# Altium schematic sheet Motor Control.SchDoc
size A
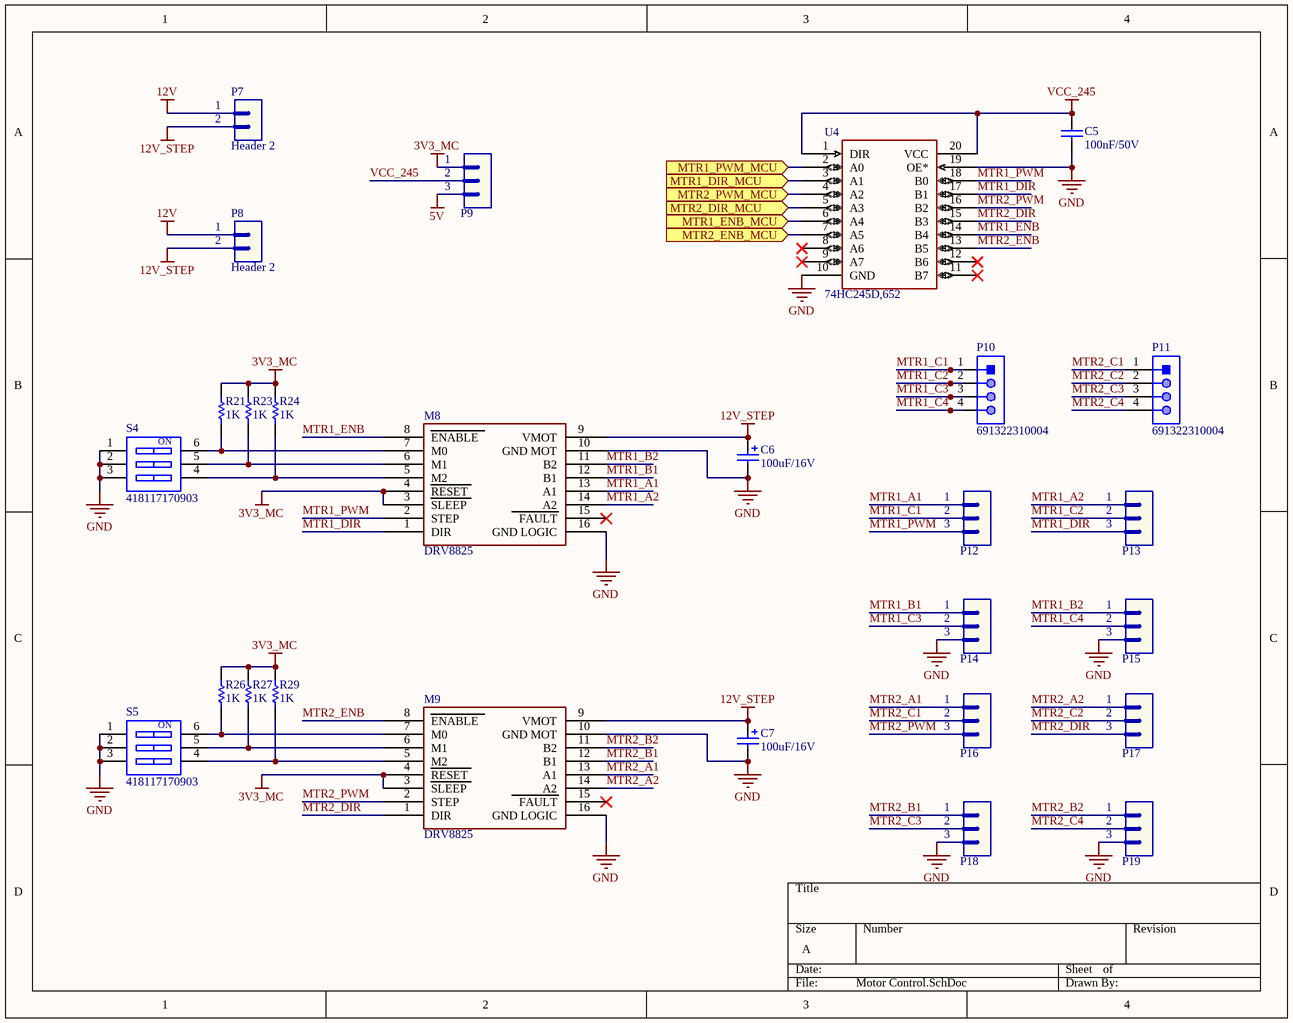
[diagram p0: Motor Control.SchDoc]

## Parts
C5  value 100nF/50V  [CAP-SM-0805]  (hidden comment: Cap-100nF-50V-0805)
C6  value 100uF/16V  [CAP-SM-AL-SIZE-D-D6L6]  (hidden comment: Cap-Al-100uF-16V-D6L5)
C7  value 100uF/16V  [CAP-SM-AL-SIZE-D-D6L6]  (hidden comment: Cap-Al-100uF-16V-D6L5)
M8  DRV8825  [DRV8825]
M9  DRV8825  [DRV8825]
P7  Header 2  [JP2]
P8  Header 2  [JP2]
P9  Header 3  [JP3]  (value not drawn)
P10  691322310004  [691322310004]
P11  691322310004  [691322310004]
P12  Header 3  [JP3]  (value not drawn)
P13  Header 3  [JP3]  (value not drawn)
P14  Header 3  [JP3]  (value not drawn)
P15  Header 3  [JP3]  (value not drawn)
P16  Header 3  [JP3]  (value not drawn)
P17  Header 3  [JP3]  (value not drawn)
P18  Header 3  [JP3]  (value not drawn)
P19  Header 3  [JP3]  (value not drawn)
R21  value 1K  [RES-SM-0805]  (hidden comment: Res-1K-0805)
R23  value 1K  [RES-SM-0805]  (hidden comment: Res-1K-0805)
R24  value 1K  [RES-SM-0805]  (hidden comment: Res-1K-0805)
R26  value 1K  [RES-SM-0805]  (hidden comment: Res-1K-0805)
R27  value 1K  [RES-SM-0805]  (hidden comment: Res-1K-0805)
R29  value 1K  [RES-SM-0805]  (hidden comment: Res-1K-0805)
S4  418117170903  [418117170903]
S5  418117170903  [418117170903]
U4  74HC245D,652  [SOT163-1_NEX]

## Ports
MTR1_DIR_MCU (in), MTR1_ENB_MCU (in), MTR1_PWM_MCU (in), MTR2_DIR_MCU (in), MTR2_ENB_MCU (in), MTR2_PWM_MCU (in)

## Nets
3V3_MC: M8.3(SLEEP) M8.4(RESET) M9.3(SLEEP) M9.4(RESET) P9.1 R21.2 R23.2 R24.2 R26.2 R27.2 R29.2
5V: P9.3
12V: P7.1 P8.1
12V_STEP: C6.1 C7.1 M8.9(VMOT) M9.9(VMOT) P7.2 P8.2
GND: C5.1 C6.2 C7.2 M8.10(GND_MOT) M8.16(GND_LOGIC) M9.10(GND_MOT) M9.16(GND_LOGIC) P14.3 P15.3 P18.3 P19.3 S4.1 S4.2 S4.3 S5.1 S5.2 S5.3 U4.10(GND) U4.19(OE*)
VCC_245: C5.2 P9.2 U4.1(DIR) U4.20(VCC)
MTR1_A1: M8.13(A1) P12.1
MTR1_A2: M8.14(A2) P13.1
MTR1_B1: M8.12(B1) P14.1
MTR1_B2: M8.11(B2) P15.1
MTR1_C1: P10.1 P12.2
MTR1_C2: P10.2 P13.2
MTR1_C3: P10.3 P14.2
MTR1_C4: P10.4 P15.2
MTR1_DIR: M8.1(DIR) P13.3 U4.17(B1)
MTR1_DIR_MCU: U4.3(A1) ; port MTR1_DIR_MCU
MTR1_ENB: M8.8(ENABLE) U4.14(B4)
MTR1_ENB_MCU: U4.6(A4) ; port MTR1_ENB_MCU
MTR1_PWM: M8.2(STEP) P12.3 U4.18(B0)
MTR1_PWM_MCU: U4.2(A0) ; port MTR1_PWM_MCU
MTR2_A1: M9.13(A1) P16.1
MTR2_A2: M9.14(A2) P17.1
MTR2_B1: M9.12(B1) P18.1
MTR2_B2: M9.11(B2) P19.1
MTR2_C1: P11.1 P16.2
MTR2_C2: P11.2 P17.2
MTR2_C3: P11.3 P18.2
MTR2_C4: P11.4 P19.2
MTR2_DIR: M9.1(DIR) P17.3 U4.15(B3)
MTR2_DIR_MCU: U4.5(A3) ; port MTR2_DIR_MCU
MTR2_ENB: M9.8(ENABLE) U4.13(B5)
MTR2_ENB_MCU: U4.7(A5) ; port MTR2_ENB_MCU
MTR2_PWM: M9.2(STEP) P16.3 U4.16(B2)
MTR2_PWM_MCU: U4.4(A2) ; port MTR2_PWM_MCU
NetM8_5: M8.5(M2) R24.1 S4.4
NetM8_6: M8.6(M1) R23.1 S4.5
NetM8_7: M8.7(M0) R21.1 S4.6
NetM9_5: M9.5(M2) R29.1 S5.4
NetM9_6: M9.6(M1) R27.1 S5.5
NetM9_7: M9.7(M0) R26.1 S5.6

Not connected (* = marked no-connect by the designer): M8 15(FAULT)*; M9 15(FAULT)*; U4 8(A6)* 9(A7)* 11(B7)* 12(B6)*

## Notes on the sheet
- (in symbol 418117170903) ON

## Library data of the parts
C5 = Cap-100nF-50V-0805: CAP CER 0.1UF 50V Y5V 0805; Manufacturer: Samsung Electro-Mechanics; Manufacturer Part Number: CL21F104ZBCNNNC; Local Supplier: thegioiic; Local Supplier Link: https://thegioiic.com/products/tu-100nf-0-1uf-50v-0805; Supplier 1: Digikey; Supplier 1 Part Number: 1276-1007-1-ND; Supplier 1 Link: https://www.digikey.com/product-detail/en/samsung-electro-mechanics/CL21F104ZBCNNNC/1276-1007-1-ND/3889093
C6 C7 = Cap-Al-100uF-16V-D6L5: CAP ALUM 100UF 20% 16V SMD; Manufacturer: Nichicon; Manufacturer Part Number: UWX1C101MCL1GB; Local Supplier: thegioiic; Local Supplier Link: https://thegioiic.com/products/tu-nhom-smd-100uf-16v-d6-3l5-4; Supplier 1: Digikey; Supplier 1 Part Number: 493-2105-1-ND; Supplier 1 Link: https://www.digikey.com/product-detail/en/nichicon/UWX1C101MCL1GB/493-2105-1-ND/590080
P7 P8 = Header 2: Header, 2-Pin; LatestRevisionDate: 17-Jul-2002; LatestRevisionNote: Re-released for DXP Platform.; Publisher: Altium Limited
P9 P12-P19 = Header 3: Header, 3-Pin; LatestRevisionDate: 17-Jul-2002; LatestRevisionNote: Re-released for DXP Platform.; Publisher: Altium Limited
P10 P11 = 691322310004: WR-TBL Serie 322 Horizontal PCB Header, Pluggable, pitch 3.81mm, 4p; Compliance: RoHS; Modularity: No; Pin Number: 4; Rated Current [UL]: 10A; Working Voltage [UL]: 300VAC; ComponentLink1Description: Manufacturer; ComponentLink1URL: http://www.we-online.de; ComponentLink2URL: https://katalog.we-online.de/em/datasheet/691322310004.pdf; ComponentLink2Description: Datasheet; Mounting Technology: THT; Part Number: 691322310004; Packaging: Box; Operating Temperature: -40 to +105degC; PCB/Cable/Panel: PCB; Pitch: 3.81mm; Published Date: October 2019; Type: Horizontal; Publisher: Wurth Elektronik; Application: Pluggable
R21 R23 R24 R26 R27 R29 = Res-1K-0805: RES 1K OHM 1% 1/4W 0805; Manufacturer: Stackpole Electronics Inc; Manufacturer Part Number: RNCP0805FTD1K00; Local Supplier: thegioiic; Local Supplier Link: https://thegioiic.com/products/dien-tro-1k-ohm-0805-5; Supplier 1: Digikey; Supplier 1 Link: https://www.digikey.com/product-detail/en/stackpole-electronics-inc/RNCP0805FTD1K00/RNCP0805FTD1K00CT-ND/2240568; Supplier 1 Part Number: RNCP0805FTD1K00CT-ND
S4 S5 = 418117170903: WS-DITV Compact THT Dip Switch, Flat Actuator, pitch 2.54mm, 3p; Operation Force: 800g; Pole Number: 3; Actuator Type: Flat Type; Circuit: SPST-NO; Rated Current Switching: 25mA; Rated Current Non-Switching: 100mA; Rated Voltage Non-Switching: 50VDC; Rated Voltage Switching: 24VDC; ComponentLink1Description: Manufacturer; ComponentLink1URL: http://www.we-online.de; ComponentLink2Description: Datasheet; ComponentLink2URL: https://katalog.we-online.com/em/datasheet/418117170903.pdf; Pitch: 2.54mm; Contact Material: Copper Alloy; Mounting Technology: THT; Operating Temperature: -40 to +85degC; Contact Plating: Gold; Packaging: Tube; Part Number: 418117170903; Publisher: Wurth Elektronik; Published Date: September 2019
M8 M9 = DRV8825: Local Supplier: HShop; Local Supplier Link: https://hshop.vn/products/mach-dieu-khien-dong-co-buoc-drv8825; Local Supplier Part Number: HS000686; Manufacturer: *; Manufacturer Part Number: *